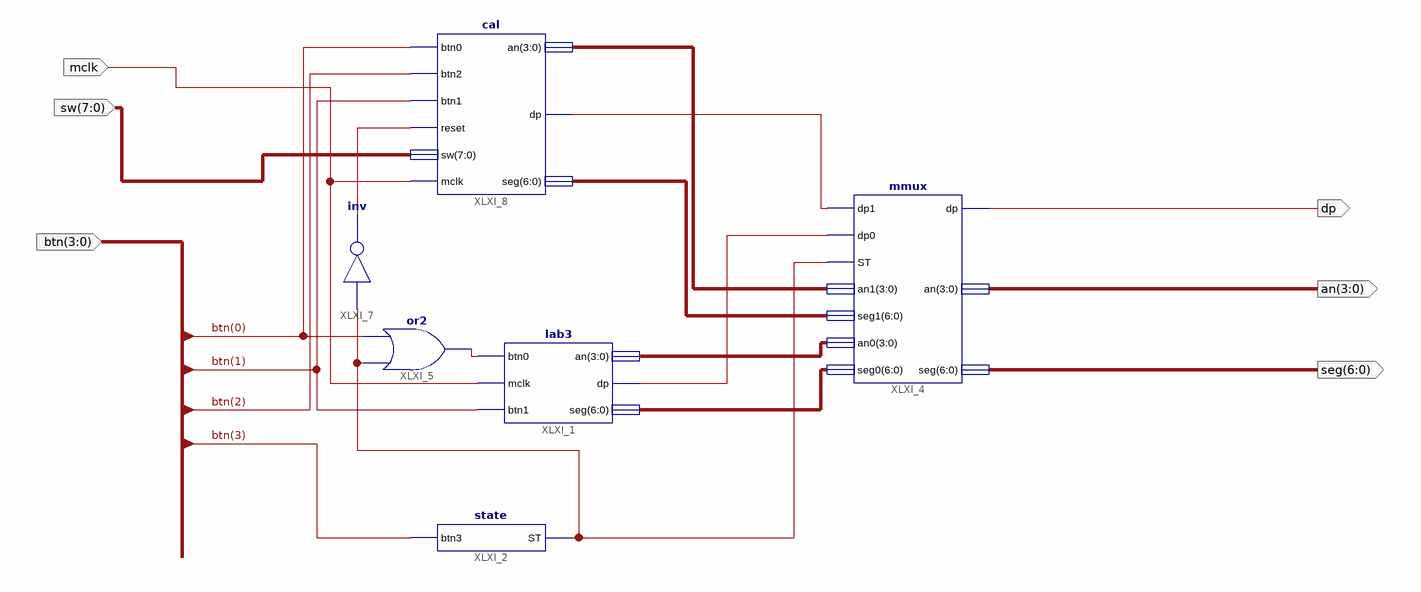
[diagram p0: schematic sheet 1]
// Xilinx ISE schematic lab4.sch (spartan3e) as structural Verilog: 6 symbols, 6 ports
module lab4 (
  input  [7:0] sw,
  input  [3:0] btn,
  input  mclk,
  output dp,
  output [3:0] an,
  output [6:0] seg
);

  wire XLXN_13, XLXN_14, XLXN_30, XLXN_32, XLXN_41;
  wire [3:0] XLXN_15, XLXN_17;
  wire [6:0] XLXN_16, XLXN_18;

  lab3 XLXI_1 (.btn0(XLXN_32), .mclk(mclk), .btn1(btn[1]), .an(XLXN_17), .dp(XLXN_13), .seg(XLXN_18));
  state XLXI_2 (.btn3(btn[3]), .ST(XLXN_30));
  mmux XLXI_4 (
    .dp1(XLXN_14), .dp0(XLXN_13), .ST(XLXN_30), .an1(XLXN_15), .seg1(XLXN_16), .an0(XLXN_17), .seg0(XLXN_18),
    .dp(dp), .an(an), .seg(seg));
  or XLXI_5 (XLXN_32, XLXN_30, btn[0]);
  not XLXI_7 (XLXN_41, XLXN_30);
  cal XLXI_8 (
    .btn0(btn[0]), .btn2(btn[2]), .btn1(btn[1]), .reset(XLXN_41), .sw(sw), .mclk(mclk), .an(XLXN_15),
    .dp(XLXN_14), .seg(XLXN_16));
endmodule
